# Altium schematic sheet 01_POWER.SchDoc
size OrCAD B
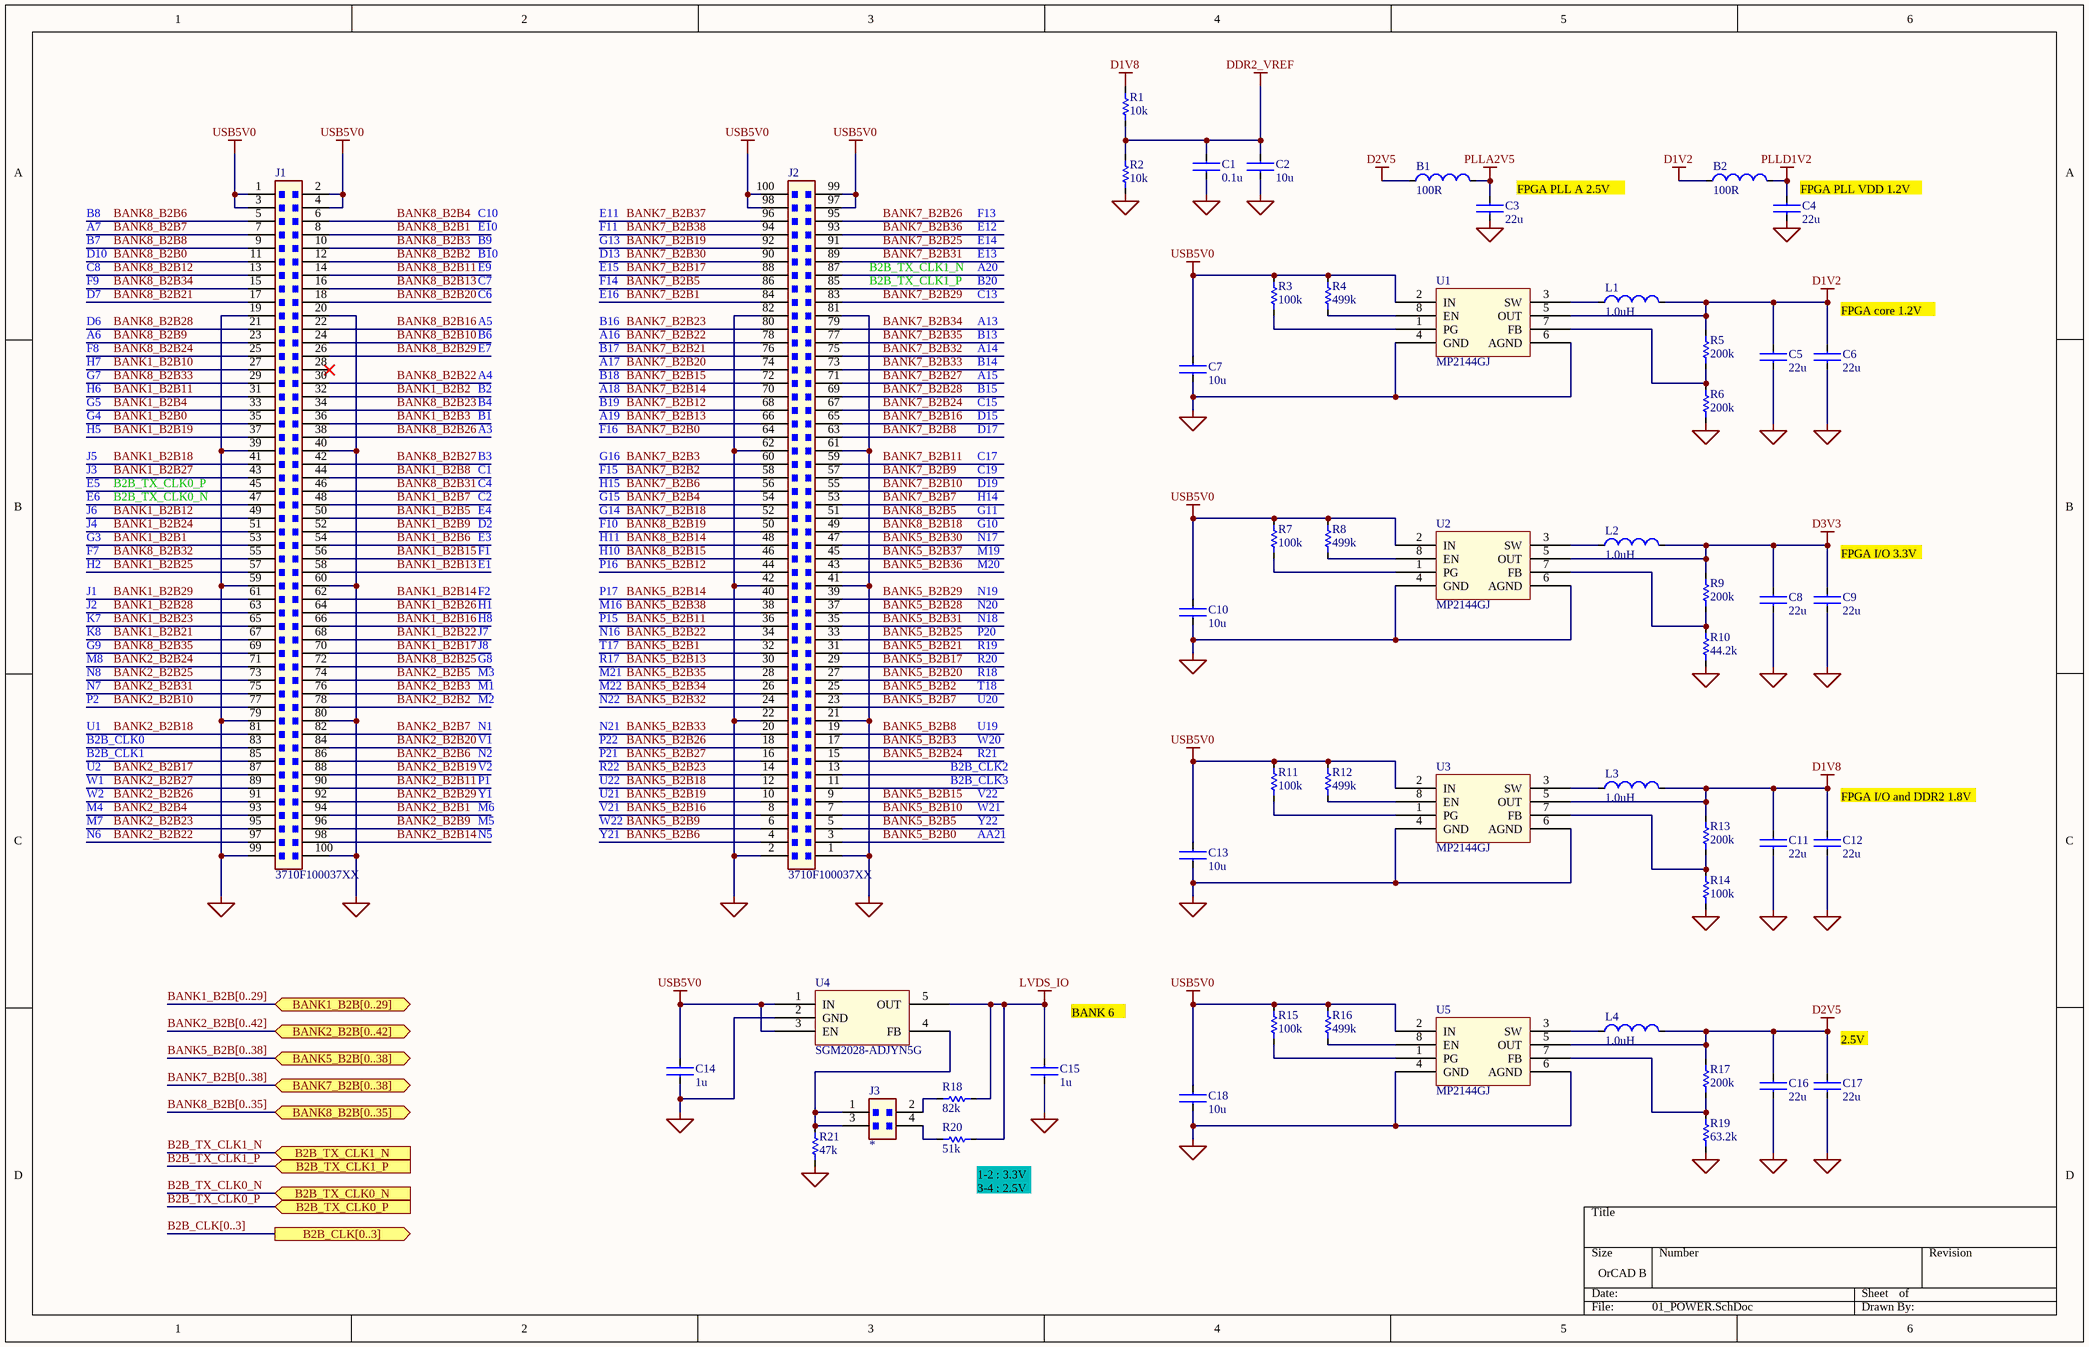
[diagram p0: 01_POWER.SchDoc]

## Parts
B1  100R  [INDC1608X09N_B0603_TAIYO]
B2  100R  [INDC1608X09N_B0603_TAIYO]
C1  0.1u  [C0402]
C2  10u  [CAPC1608X09N_C0603]
C3  22u  [CAPC1608X09N_C0603]
C4  22u  [CAPC1608X09N_C0603]
C5  22u  [CAPC1608X09N_C0603]
C6  22u  [CAPC1608X09N_C0603]
C7  10u  [CAPC1608X09N_C0603]
C8  22u  [CAPC1608X09N_C0603]
C9  22u  [CAPC1608X09N_C0603]
C10  10u  [CAPC1608X09N_C0603]
C11  22u  [CAPC1608X09N_C0603]
C12  22u  [CAPC1608X09N_C0603]
C13  10u  [CAPC1608X09N_C0603]
C14  1u  [CAPC1608X09N_C0603]
C15  1u  [CAPC1608X09N_C0603]
C16  22u  [CAPC1608X09N_C0603]
C17  22u  [CAPC1608X09N_C0603]
C18  10u  [CAPC1608X09N_C0603]
J1  3710F100037XX  [3710F100037XX]
J2  3710F100037XX  [3710F100037XX]
J3  *  [334202XX30000]
L1  1.0uH  [NR3015T1R0N]
L2  1.0uH  [NR3015T1R0N]
L3  1.0uH  [NR3015T1R0N]
L4  1.0uH  [NR3015T1R0N]
R1  10k  [R0402]
R2  10k  [R0402]
R3  100k  [R0402]
R4  499k  [R0402]
R5  200k  [R0402]
R6  200k  [R0402]
R7  100k  [R0402]
R8  499k  [R0402]
R9  200k  [R0402]
R10  44.2k  [R0402]
R11  100k  [R0402]
R12  499k  [R0402]
R13  200k  [R0402]
R14  100k  [R0402]
R15  100k  [R0402]
R16  499k  [R0402]
R17  200k  [R0402]
R18  82k  [R0402]
R19  63.2k  [R0402]
R20  51k  [R0402]
R21  47k  [R0402]
U1  MP2144GJ  [TSOT23-8_MP2144GJ]
U2  MP2144GJ  [TSOT23-8_MP2144GJ]
U3  MP2144GJ  [TSOT23-8_MP2144GJ]
U4  SGM2028-ADJYN5G  [SOT95P280X125-5N_SGM2028]
U5  MP2144GJ  [TSOT23-8_MP2144GJ]

## Ports
B2B_CLK[0..3] (out), B2B_TX_CLK0_N (in), B2B_TX_CLK0_P (in), B2B_TX_CLK1_N (in), B2B_TX_CLK1_P (in), BANK1_B2B[0..29] (bidir), BANK2_B2B[0..42] (bidir), BANK5_B2B[0..38] (bidir), BANK7_B2B[0..38] (bidir), BANK8_B2B[0..35] (bidir)

## Nets
D1V2: B2.2 C5.1 C6.1 L1.1 R5.2 U1.5(OUT)
D1V8: C11.1 C12.1 L3.1 R1.2 R13.2 U3.5(OUT)
D2V5: B1.2 C16.1 C17.1 L4.1 R17.2 U5.5(OUT)
D3V3: C8.1 C9.1 L2.1 R9.2 U2.5(OUT)
DDR2_VREF: C1.1 C2.1 R1.1 R2.2
GND: C1.2 C2.2 C3.2 C4.2 C5.2 C6.2 C7.2 C8.2 C9.2 C10.2 C11.2 C12.2 C13.2 C14.2 C15.2 C16.2 C17.2 C18.2 J1.19 J1.20 J1.39 J1.40 J1.59 J1.60 J1.79 J1.80 J1.99 J1.100 J2.1 J2.2 J2.21 J2.22 J2.41 J2.42 J2.61 J2.62 J2.81 J2.82 R2.1 R6.1 R10.1 R14.1 R19.1 R21.1 U1.4(GND) U1.6(AGND) U2.4(GND) U2.6(AGND) U3.4(GND) U3.6(AGND) U4.2(GND) U5.4(GND) U5.6(AGND)
LVDS_IO: C15.1 R18.2 R20.2 U4.5(OUT)
PLLA2V5: B1.1 C3.1
PLLD1V2: B2.1 C4.1
USB5V0: C7.1 C10.1 C13.1 C14.1 C18.1 J1.1 J1.2 J1.3 J1.4 J2.97 J2.98 J2.99 J2.100 R3.2 R4.2 R7.2 R8.2 R11.2 R12.2 R15.2 R16.2 U1.2(IN) U2.2(IN) U3.2(IN) U4.1(IN) U4.3(EN) U5.2(IN)
A3: J1.38  [also labelled BANK8_B2B26]
A4: J1.30  [also labelled BANK8_B2B22]
A5: J1.22  [also labelled BANK8_B2B16]
A6: J1.23  [also labelled BANK8_B2B9]
A7: J1.7  [also labelled BANK8_B2B7]
A13: J2.79  [also labelled BANK7_B2B34]
A14: J2.75  [also labelled BANK7_B2B32]
A15: J2.71  [also labelled BANK7_B2B27]
A16: J2.78  [also labelled BANK7_B2B22]
A17: J2.74  [also labelled BANK7_B2B20]
A18: J2.70  [also labelled BANK7_B2B14]
A19: J2.66  [also labelled BANK7_B2B13]
A20: J2.87 ; port B2B_TX_CLK1_N  [also labelled B2B_TX_CLK1_N]
AA21: J2.3  [also labelled BANK5_B2B0]
B1: J1.36  [also labelled BANK1_B2B3]
B2: J1.32  [also labelled BANK1_B2B2]
B2B_CLK0: J1.83
B2B_CLK1: J1.85
B2B_CLK2: J2.13
B2B_CLK3: J2.11
B2B_TX_CLK0_N: J1.47 ; port B2B_TX_CLK0_N  [also labelled E6]
B2B_TX_CLK0_P: J1.45 ; port B2B_TX_CLK0_P  [also labelled E5]
B3: J1.42  [also labelled BANK8_B2B27]
B4: J1.34  [also labelled BANK8_B2B23]
B6: J1.24  [also labelled BANK8_B2B10]
B7: J1.9  [also labelled BANK8_B2B8]
B8: J1.5  [also labelled BANK8_B2B6]
B9: J1.10  [also labelled BANK8_B2B3]
B10: J1.12  [also labelled BANK8_B2B2]
B13: J2.77  [also labelled BANK7_B2B35]
B14: J2.73  [also labelled BANK7_B2B33]
B15: J2.69  [also labelled BANK7_B2B28]
B16: J2.80  [also labelled BANK7_B2B23]
B17: J2.76  [also labelled BANK7_B2B21]
B18: J2.72  [also labelled BANK7_B2B15]
B19: J2.68  [also labelled BANK7_B2B12]
B20: J2.85 ; port B2B_TX_CLK1_P  [also labelled B2B_TX_CLK1_P]
BANK1_B2B0: J1.35  [also labelled G4]
BANK1_B2B1: J1.53  [also labelled G3]
BANK1_B2B4: J1.33  [also labelled G5]
BANK1_B2B5: J1.50  [also labelled E4]
BANK1_B2B6: J1.54  [also labelled E3]
BANK1_B2B7: J1.48  [also labelled C2]
BANK1_B2B8: J1.44  [also labelled C1]
BANK1_B2B9: J1.52  [also labelled D2]
BANK1_B2B10: J1.27  [also labelled H7]
BANK1_B2B11: J1.31  [also labelled H6]
BANK1_B2B12: J1.49  [also labelled J6]
BANK1_B2B13: J1.58  [also labelled E1]
BANK1_B2B14: J1.62  [also labelled F2]
BANK1_B2B15: J1.56  [also labelled F1]
BANK1_B2B16: J1.66  [also labelled H8]
BANK1_B2B17: J1.70  [also labelled J8]
BANK1_B2B18: J1.41  [also labelled J5]
BANK1_B2B19: J1.37  [also labelled H5]
BANK1_B2B21: J1.67  [also labelled K8]
BANK1_B2B22: J1.68  [also labelled J7]
BANK1_B2B23: J1.65  [also labelled K7]
BANK1_B2B24: J1.51  [also labelled J4]
BANK1_B2B25: J1.57  [also labelled H2]
BANK1_B2B26: J1.64  [also labelled H1]
BANK1_B2B27: J1.43  [also labelled J3]
BANK1_B2B28: J1.63  [also labelled J2]
BANK1_B2B29: J1.61  [also labelled J1]
BANK2_B2B1: J1.94  [also labelled M6]
BANK2_B2B2: J1.78  [also labelled M2]
BANK2_B2B3: J1.76  [also labelled M1]
BANK2_B2B4: J1.93  [also labelled M4]
BANK2_B2B5: J1.74  [also labelled M3]
BANK2_B2B6: J1.86  [also labelled N2]
BANK2_B2B7: J1.82  [also labelled N1]
BANK2_B2B9: J1.96  [also labelled M5]
BANK2_B2B10: J1.77  [also labelled P2]
BANK2_B2B11: J1.90  [also labelled P1]
BANK2_B2B14: J1.98  [also labelled N5]
BANK2_B2B17: J1.87  [also labelled U2]
BANK2_B2B18: J1.81  [also labelled U1]
BANK2_B2B19: J1.88  [also labelled V2]
BANK2_B2B20: J1.84  [also labelled V1]
BANK2_B2B22: J1.97  [also labelled N6]
BANK2_B2B23: J1.95  [also labelled M7]
BANK2_B2B24: J1.71  [also labelled M8]
BANK2_B2B25: J1.73  [also labelled N8]
BANK2_B2B26: J1.91  [also labelled W2]
BANK2_B2B27: J1.89  [also labelled W1]
BANK2_B2B29: J1.92  [also labelled Y1]
BANK2_B2B31: J1.75  [also labelled N7]
BANK5_B2B1: J2.32  [also labelled T17]
BANK5_B2B2: J2.25  [also labelled T18]
BANK5_B2B3: J2.17  [also labelled W20]
BANK5_B2B5: J2.5  [also labelled Y22]
BANK5_B2B6: J2.4  [also labelled Y21]
BANK5_B2B7: J2.23  [also labelled U20]
BANK5_B2B8: J2.19  [also labelled U19]
BANK5_B2B9: J2.6  [also labelled W22]
BANK5_B2B10: J2.7  [also labelled W21]
BANK5_B2B11: J2.36  [also labelled P15]
BANK5_B2B12: J2.44  [also labelled P16]
BANK5_B2B13: J2.30  [also labelled R17]
BANK5_B2B14: J2.40  [also labelled P17]
BANK5_B2B15: J2.9  [also labelled V22]
BANK5_B2B16: J2.8  [also labelled V21]
BANK5_B2B17: J2.29  [also labelled R20]
BANK5_B2B18: J2.12  [also labelled U22]
BANK5_B2B19: J2.10  [also labelled U21]
BANK5_B2B20: J2.27  [also labelled R18]
BANK5_B2B21: J2.31  [also labelled R19]
BANK5_B2B22: J2.34  [also labelled N16]
BANK5_B2B23: J2.14  [also labelled R22]
BANK5_B2B24: J2.15  [also labelled R21]
BANK5_B2B25: J2.33  [also labelled P20]
BANK5_B2B26: J2.18  [also labelled P22]
BANK5_B2B27: J2.16  [also labelled P21]
BANK5_B2B28: J2.37  [also labelled N20]
BANK5_B2B29: J2.39  [also labelled N19]
BANK5_B2B30: J2.47  [also labelled N17]
BANK5_B2B31: J2.35  [also labelled N18]
BANK5_B2B32: J2.24  [also labelled N22]
BANK5_B2B33: J2.20  [also labelled N21]
BANK5_B2B34: J2.26  [also labelled M22]
BANK5_B2B35: J2.28  [also labelled M21]
BANK5_B2B36: J2.43  [also labelled M20]
BANK5_B2B37: J2.45  [also labelled M19]
BANK5_B2B38: J2.38  [also labelled M16]
BANK7_B2B0: J2.64  [also labelled F16]
BANK7_B2B1: J2.84  [also labelled E16]
BANK7_B2B2: J2.58  [also labelled F15]
BANK7_B2B3: J2.60  [also labelled G16]
BANK7_B2B4: J2.54  [also labelled G15]
BANK7_B2B5: J2.86  [also labelled F14]
BANK7_B2B6: J2.56  [also labelled H15]
BANK7_B2B7: J2.53  [also labelled H14]
BANK7_B2B8: J2.63  [also labelled D17]
BANK7_B2B9: J2.57  [also labelled C19]
BANK7_B2B10: J2.55  [also labelled D19]
BANK7_B2B11: J2.59  [also labelled C17]
BANK7_B2B16: J2.65  [also labelled D15]
BANK7_B2B17: J2.88  [also labelled E15]
BANK7_B2B18: J2.52  [also labelled G14]
BANK7_B2B19: J2.92  [also labelled G13]
BANK7_B2B24: J2.67  [also labelled C15]
BANK7_B2B25: J2.91  [also labelled E14]
BANK7_B2B26: J2.95  [also labelled F13]
BANK7_B2B29: J2.83  [also labelled C13]
BANK7_B2B30: J2.90  [also labelled D13]
BANK7_B2B31: J2.89  [also labelled E13]
BANK7_B2B36: J2.93  [also labelled E12]
BANK7_B2B37: J2.96  [also labelled E11]
BANK7_B2B38: J2.94  [also labelled F11]
BANK8_B2B0: J1.11  [also labelled D10]
BANK8_B2B1: J1.8  [also labelled E10]
BANK8_B2B4: J1.6  [also labelled C10]
BANK8_B2B5: J2.51  [also labelled G11]
BANK8_B2B11: J1.14  [also labelled E9]
BANK8_B2B12: J1.13  [also labelled C8]
BANK8_B2B13: J1.16  [also labelled C7]
BANK8_B2B14: J2.48  [also labelled H11]
BANK8_B2B15: J2.46  [also labelled H10]
BANK8_B2B18: J2.49  [also labelled G10]
BANK8_B2B19: J2.50  [also labelled F10]
BANK8_B2B20: J1.18  [also labelled C6]
BANK8_B2B21: J1.17  [also labelled D7]
BANK8_B2B24: J1.25  [also labelled F8]
BANK8_B2B25: J1.72  [also labelled G8]
BANK8_B2B28: J1.21  [also labelled D6]
BANK8_B2B29: J1.26  [also labelled E7]
BANK8_B2B31: J1.46  [also labelled C4]
BANK8_B2B32: J1.55  [also labelled F7]
BANK8_B2B33: J1.29  [also labelled G7]
BANK8_B2B34: J1.15  [also labelled F9]
BANK8_B2B35: J1.69  [also labelled G9]
NetJ3_1: J3.1 J3.3 R21.2 U4.4(FB)
NetJ3_2: J3.2 R18.1
NetJ3_4: J3.4 R20.1
NetL1_2: L1.2 U1.3(SW)
NetL2_2: L2.2 U2.3(SW)
NetL3_2: L3.2 U3.3(SW)
NetL4_2: L4.2 U5.3(SW)
NetR3_1: R3.1 U1.1(PG)
NetR4_1: R4.1 U1.8(EN)
NetR5_1: R5.1 R6.2 U1.7(FB)
NetR7_1: R7.1 U2.1(PG)
NetR8_1: R8.1 U2.8(EN)
NetR9_1: R9.1 R10.2 U2.7(FB)
NetR11_1: R11.1 U3.1(PG)
NetR12_1: R12.1 U3.8(EN)
NetR13_1: R13.1 R14.2 U3.7(FB)
NetR15_1: R15.1 U5.1(PG)
NetR16_1: R16.1 U5.8(EN)
NetR17_1: R17.1 R19.2 U5.7(FB)

Not connected (* = marked no-connect by the designer): J1 28*

## Buses and harness runs
bus B2B_CLK[0..3] = port B2B_CLK[0..3]
bus BANK1_B2B[0..29] = port BANK1_B2B[0..29]
bus BANK2_B2B[0..42] = port BANK2_B2B[0..42]
bus BANK5_B2B[0..38] = port BANK5_B2B[0..38]
bus BANK7_B2B[0..38] = port BANK7_B2B[0..38]
bus BANK8_B2B[0..35] = port BANK8_B2B[0..35]

## Notes on the sheet
- (near C3) FPGA PLL A 2.5V
- (near C4) FPGA PLL VDD 1.2V
- (near C6) FPGA core 1.2V
- (near C9) FPGA I/O 3.3V
- (near C12) FPGA I/O and DDR2 1.8V
- BANK 6
- (near C17) 2.5V
- (near R20) 1-2 : 3.3V
  3-4 : 2.5V

## Library data of the parts
B1 B2 = FBMH1608HM101-T: Bead,100R,2500mA,0.035ohm,0603; Manufacturer1: YAIYO YUDEN; Manufacturer2: *; PartNumberManufacturer2: *; PartNumberManufacturer1: FBMH1608HM101-T; UnitPrice: *; Value: 100R
C1 = CAP011: CAP,Ceramic,X7R,10%,16V,0.1uF,0402; Manufacturer1: *; Manufacturer2: *; PartNumberManufacturer1: *; UnitPrice: *; Value: 0.1u
C2 C7 C10 C13 C18 = CAP113: CAP,Ceramic,X7R,10%,6.3V,10uF,0603; Manufacturer1: *; Manufacturer2: *; PartNumberManufacturer1: *; UnitPrice: *; Value: 10u
C3-C6 C8 C9 C11 C12 C16 C17 = CAP114: CAP,Ceramic,X7R,10%,6.3V,22uF,0603; Manufacturer1: *; Manufacturer2: *; PartNumberManufacturer1: *; UnitPrice: *; Value: 22u
C14 C15 = CAP12: CAP,Ceramic,X7R,10%,16V,1uF,0603; Manufacturer1: *; Manufacturer2: *; PartNumberManufacturer1: *; UnitPrice: *; Value: 1u
J1 J2 = 3710F100037XX: B2B female,100Pin,Vertical,0.8mm Pitch,SMD; Manufacturer1: JK; Manufacturer2: *; PartNumberManufacturer1: 3710F100037XX; PartNumberManufacturer2: *; UnitPrice: *
J3 = 334202XX30000: Header,4Pin,Vertical,1.27mm Pitch,SMD; Manufacturer1: *; Manufacturer2: *; PartNumberManufacturer1: *; PartNumberManufacturer2: *; UnitPrice: *
L1-L4 = NR3015T1R0N: Inductor,1.0uH,2100mA,0.03ohm,SMD; Manufacturer1: TAIYO YUDEN; Manufacturer2: *; PartNumberManufacturer2: *; PartNumberManufacturer1: NR3015T1R0N; UnitPrice: *; Value: 1.0uH
R1 R2 = RES012: RES,10k,1%,1/16W,0402; Manufacturer1: *; PartNumberManufacturer2: *; Manufacturer2: *; PartNumberManufacturer1: *; Value: 10k; UnitPrice: *
R3 R7 R11 R14 R15 = RES013: RES,100k,1%,1/16W,0402; Manufacturer1: *; PartNumberManufacturer2: *; Manufacturer2: *; PartNumberManufacturer1: *; Value: 100k; UnitPrice: *
R4 R8 R12 R16 = RES0117_1: RES,499k,1%,1/16W,0402; Manufacturer1: *; PartNumberManufacturer2: *; Manufacturer2: *; PartNumberManufacturer1: *; Value: 499k; UnitPrice: *
R5 R6 R9 R13 R17 = RES0117: RES,200k,1%,1/16W,0402; Manufacturer1: *; PartNumberManufacturer2: *; Manufacturer2: *; PartNumberManufacturer1: *; Value: 200k; UnitPrice: *
R10 = RES0124_1: RES,44.2k,1%,1/16W,0402; Manufacturer1: *; PartNumberManufacturer2: *; Manufacturer2: *; PartNumberManufacturer1: *; Value: 44.2k; UnitPrice: *
R18 = RES0123_1: RES,82k,1%,1/16W,0402; Manufacturer1: *; PartNumberManufacturer2: *; Manufacturer2: *; PartNumberManufacturer1: *; Value: 82k; UnitPrice: *
R19 = RES0126_1: RES,63.2k,1%,1/16W,0402; Manufacturer1: *; PartNumberManufacturer2: *; Manufacturer2: *; PartNumberManufacturer1: *; Value: 63.2k; UnitPrice: *
R20 = RES014_1: RES,51k,1%,1/16W,0402; Manufacturer1: *; PartNumberManufacturer2: *; Manufacturer2: *; PartNumberManufacturer1: *; Value: 51k; UnitPrice: *
R21 = RES0127: RES,47k,1%,1/16W,0402; Manufacturer1: *; PartNumberManufacturer2: *; Manufacturer2: *; PartNumberManufacturer1: *; Value: 47k; UnitPrice: *
U1-U3 U5 = MP2144GJ: IC,DC/DC,2A,1.2MHz,TSOT23-8; Manufacturer1: MPS; PartNumberManufacturer1: MP2144GJ; Manufacturer2: *; PartNumberManufacturer2: *; UnitPrice: *
U4 = SGM2028-ADJ: IC,LDO 500mA,Adjustable,SOT23-5; Manufacturer1: SGM; PartNumberManufacturer1: SGM2028-ADJYN5G; Manufacturer2: *; PartNumberManufacturer2: *; UnitPrice: *